# Altium project STM32F4 MCU.PrjPcb
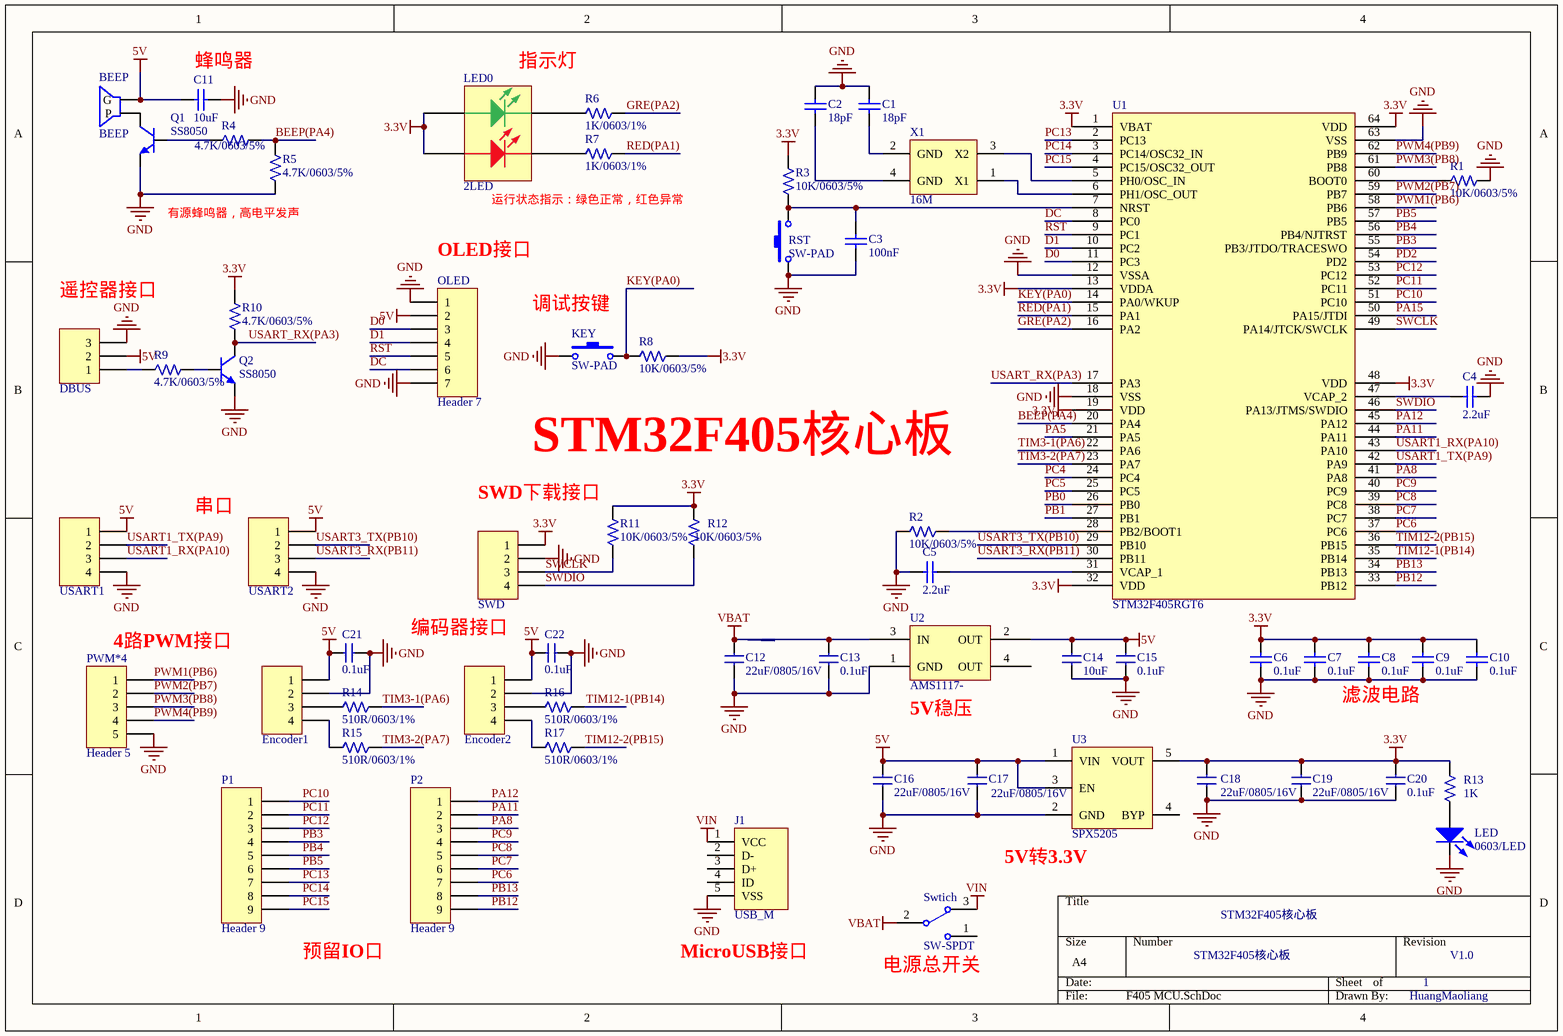
[diagram p0: F405 MCU.SchDoc]
1 sheet, 62 parts. Net scope: global (net labels, ports and power ports of the same name join across sheets).
Board file: F405 MCU.PcbDoc

## Sheet F405 MCU.SchDoc
size A4

### Parts
BEEP  BEEP  [BELL-5]
C1  18pF  [CAP-0603]
C2  18pF  [CAP-0603]
C3  100nF  [CAP-0603]
C4  2.2uF  [CAP-0603]
C5  2.2uF  [CAP-0603]
C6  0.1uF  [CAP-0603]
C7  0.1uF  [CAP-0603]
C8  0.1uF  [CAP-0603]
C9  0.1uF  [CAP-0603]
C10  0.1uF  [CAP-0603]
C11  10uF  [CAP-0603]
C12  22uF/0805/16V  [0805]
C13  0.1uF  [0603]
C14  10uF  [0603]
C15  0.1uF  [0603]
C16  22uF/0805/16V  [0805]
C17  22uF/0805/16V  [0805]
C18  22uF/0805/16V  [0805]
C19  22uF/0805/16V  [0805]
C20  0.1uF  [0603]
C21  0.1uF  [0603]
C22  0.1uF  [0603]
DBUS  Header 3  [HDR3X1_A]  (value not drawn)
Encoder1  Header 4  [HDR4X1_A]  (value not drawn)
Encoder2  Header 4  [HDR4X1_A]  (value not drawn)
J1  USB_M  [USB-MICRO]
KEY  SW-PAD  [SW_PAD1]
LED  0603/LED  [0603]
LED0  2LED  [LED-2-1206]
OLED  Header 7  [HDR1X7]
P1  Header 9  [HDR1X9]
P2  Header 9  [HDR1X9]
PWM*4  Header 5  [HDR1X5]
Q1  SS8050  [SOT-23]
Q2  SS8050  [SOT-23]
R1  10K/0603/5%  [0603]
R2  10K/0603/5%  [0603]
R3  10K/0603/5%  [0603]
R4  4.7K/0603/5%  [0603]
R5  4.7K/0603/5%  [0603]
R6  1K/0603/1%  [0603]
R7  1K/0603/1%  [0603]
R8  10K/0603/5%  [0603]
R9  4.7K/0603/5%  [0603]
R10  4.7K/0603/5%  [0603]
R11  10K/0603/5%  [0603]
R12  10K/0603/5%  [0603]
R13  1K  [0603]
R14  510R/0603/1%  [0603]
R15  510R/0603/1%  [0603]
R16  510R/0603/1%  [0603]
R17  510R/0603/1%  [0603]
RST  SW-PAD  [SW_PAD1]
SWD  Header 4  [HDR4X1_A]  (value not drawn)
Swtich  SW-SPDT  [MSK-12D19]
U1  STM32F405RGT6  [STM32F405RGT6 - duplicate]
U2  AMS1117-  [SOT-89-3]
U3  SPX5205  [SPX5205M5-3.3V]
USART1  Header 4  [HDR4X1_A]  (value not drawn)
USART2  Header 4  [HDR4X1_A]  (value not drawn)
X1  16M  [X-3225]

### Nets
3.3V: C6.2 C7.2 C8.2 C9.2 C10.2 C18.2 C19.2 C20.2 LED0.1 LED0.2 R3.2 R8.2 R10.2 R11.2 R12.2 R13.2 SWD.1 U1.1(VBAT) U1.13(VDDA) U1.19(VDD) U1.32(VDD) U1.48(VDD) U1.64(VDD) U3.5(VOUT)
5V: BEEP.2(G) C11.1 C14.2 C15.2 C16.2 C17.2 C21.2 C22.1 DBUS.2 Encoder1.1 Encoder2.1 OLED.2 U2.2(OUT) U3.1(VIN) U3.3(EN) USART1.1 USART2.1
GND: C1.2 C2.2 C3.1 C4.1 C5.2 C6.1 C7.1 C8.1 C9.1 C10.1 C11.2 C12.1 C13.1 C14.1 C15.1 C16.1 C17.1 C18.1 C19.1 C20.1 C21.1 C22.2 DBUS.3 Encoder1.2 Encoder2.2 J1.5(VSS) KEY.1 LED.2(K) OLED.1 OLED.7 PWM*4.5 Q1.2(E) Q2.2(E) R1.2 R2.1 R5.2 RST.1 SWD.2 U1.12(VSSA) U1.18(VSS) U1.63(VSS) U2.1(GND) U3.2(GND) USART1.4 USART2.4
VBAT: C12.2 C13.2 Swtich.2 U2.3(IN)
VIN: J1.1(VCC) Swtich.3
BEEP(PA4): R4.1 R5.1 U1.20(PA4)
D0: OLED.3 U1.11(PC3)
D1: OLED.4 U1.10(PC2)
DC: OLED.6 U1.8(PC0)
GRE(PA2): R6.2 U1.16(PA2)
KEY(PA0): KEY.2 R8.1 U1.14(PA0/WKUP)
PA5: U1.21(PA5)
PA8: P2.3 U1.41(PA8)
PA11: P2.2 U1.44(PA11)
PA12: P2.1 U1.45(PA12)
PA15: U1.50(PA15/JTDI)
PB0: U1.26(PB0)
PB1: U1.27(PB1)
PB3: P1.4 U1.55(PB3/JTDO/TRACESWO)
PB4: P1.5 U1.56(PB4/NJTRST)
PB5: P1.6 U1.57(PB5)
PB12: P2.9 U1.33(PB12)
PB13: P2.8 U1.34(PB13)
PC4: U1.24(PC4)
PC5: U1.25(PC5)
PC6: P2.7 U1.37(PC6)
PC7: P2.6 U1.38(PC7)
PC8: P2.5 U1.39(PC8)
PC9: P2.4 U1.40(PC9)
PC10: P1.1 U1.51(PC10)
PC11: P1.2 U1.52(PC11)
PC12: P1.3 U1.53(PC12)
PC13: P1.7 U1.2(PC13)
PC14: P1.8 U1.3(PC14/OSC32_IN)
PC15: P1.9 U1.4(PC15/OSC32_OUT)
PD2: U1.54(PD2)
PWM1(PB6): PWM*4.1 U1.58(PB6)
PWM2(PB7): PWM*4.2 U1.59(PB7)
PWM3(PB8): PWM*4.3 U1.61(PB8)
PWM4(PB9): PWM*4.4 U1.62(PB9)
RED(PA1): R7.2 U1.15(PA1)
RST: OLED.5 U1.9(PC1)
SWCLK: R11.1 SWD.3 U1.49(PA14/JTCK/SWCLK)
SWDIO: R12.1 SWD.4 U1.46(PA13/JTMS/SWDIO)
TIM3-1(PA6): R14.2 U1.22(PA6)
TIM3-2(PA7): R15.2 U1.23(PA7)
TIM12-1(PB14): R16.2 U1.35(PB14)
TIM12-2(PB15): R17.2 U1.36(PB15)
USART1_RX(PA10): U1.43(PA10) USART1.3
USART1_TX(PA9): U1.42(PA9) USART1.2
USART3_RX(PB11): U1.30(PB11) USART2.3
USART3_TX(PB10): U1.29(PB10) USART2.2
USART_RX(PA3): Q2.3(C) R10.1 U1.17(PA3)
NetBEEP_1: BEEP.1(P) Q1.3(C)
NetC1_1: C1.1 X1.2(GND)
NetC2_1: C2.1 X1.4(GND)
NetC3_2: C3.2 R3.1 RST.2 U1.7(NRST)
NetC4_2: C4.2 U1.47(VCAP_2)
NetC5_1: C5.1 U1.31(VCAP_1)
NetDBUS_1: DBUS.1 R9.1
NetEncoder1_3: Encoder1.3 R14.1
NetEncoder1_4: Encoder1.4 R15.1
NetEncoder2_3: Encoder2.3 R16.1
NetEncoder2_4: Encoder2.4 R17.1
NetLED0_3: LED0.3 R6.1
NetLED0_4: LED0.4 R7.1
NetLED_1: LED.1(A) R13.1
NetQ1_1: Q1.1(B) R4.2
NetQ2_1: Q2.1(B) R9.2
NetR1_1: R1.1 U1.60(BOOT0)
NetR2_2: R2.2 U1.28(PB2/BOOT1)
NetU1_5: U1.5(PH0/OSC_IN) X1.3(X2)
NetU1_6: U1.6(PH1/OSC_OUT) X1.1(X1)

Not connected (* = marked no-connect by the designer): J1 2(D-) 3(D+) 4(ID); Swtich 1; U2 4(OUT); U3 4(BYP)

### Notes on the sheet
- (near C11) 蜂鸣器
- 指示灯
- 有源蜂鸣器，高电平发声
- 运行状态指示：绿色正常，红色异常
- (near DBUS) 遥控器接口
- (near OLED) OLED接口
- (near KEY) 调试按键
- 串口
- (near SWD) SWD下载接口
- STM32F405核心板
- (near PWM*4) 4路PWM接口
- 编码器接口
- (near U2) 5V稳压
- (near C8) 滤波电路
- (near U3) 5V转3.3V
- (near P1) 预留IO口
- (near J1) MicroUSB接口
- (near Swtich) 电源总开关
- 1
- V1.0
- HuangMaoliang

### Library data of the parts
C1-C11 = Cap: 无极性电容; Value: 100pF; Published: 8-Jun-2000; LatestRevisionDate: 17-Jul-2002; LatestRevisionNote: Re-released for DXP Platform.; PackageReference: RAD-0.3; Publisher: Altium Limited
C12 C16-C19 = CAP/0805
C13-C15 C20-C22 = CAP/0603
DBUS = Header 3: 接插件; LatestRevisionDate: 17-Jul-2002; LatestRevisionNote: Re-released for DXP Platform.; Publisher: Altium Limited
Encoder1 Encoder2 SWD USART1 USART2 = Header 4: 接插件; LatestRevisionDate: 17-Jul-2002; LatestRevisionNote: Re-released for DXP Platform.; Publisher: Altium Limited
J1 = USB_M: MicroUSB接口
KEY RST = SW-PAD: 微动开关; Published: 24-Mar-1999; LatestRevisionDate: 17-Jul-2002; LatestRevisionNote: Re-released for DXP Platform.; PackageReference: SPST-2; Publisher: Altium Limited
OLED = Header 7: Header, 7-Pin; LatestRevisionDate: 17-Jul-2002; LatestRevisionNote: Re-released for DXP Platform.; Publisher: Altium Limited
P1 P2 = Header 9: Header, 9-Pin; LatestRevisionDate: 17-Jul-2002; LatestRevisionNote: Re-released for DXP Platform.; Publisher: Altium Limited
PWM*4 = Header 5: Header, 5-Pin; LatestRevisionDate: 17-Jul-2002; LatestRevisionNote: Re-released for DXP Platform.; Publisher: Altium Limited
Q1 Q2 = SS8050: NPN贴片三极管; Published: 8-Jun-2000; LatestRevisionDate: 15-Jan-2003; LatestRevisionNote: PCB Footprint 'BCY-W3/D4.7' replaced; DatasheetDocument: 1997; PackageDocument: Sep-1998; PackageReference: TO-92A; Publisher: Altium Limited; Code_JEDEC: TO-92A; ComponentLink1Description: Manufacturer Link; ComponentLink1URL: http://www.fairchildsemi.com/; ComponentLink2Description: Datasheet; ComponentLink2URL: http://www.fairchildsemi.com/ds/2N%2F2N3904.pdf
R1-R17 = RES/0603
Swtich = SW-SPDT: 开关; Published: 24-Mar-1999; LatestRevisionDate: 17-Dec-2003; LatestRevisionNote: Schematic revised, PCB Footprint replaced.; DatasheetDocument: 05-Dec-2000; PackageReference: TL36WW15050; Publisher: Altium Limited; ComponentLink1Description: Manufacturer Link; ComponentLink1URL: http://www.apem.com
U2 = AMS1117: 稳压芯片
U3 = SPX5205M5-3.3V: 5转3.3V LDO
X1 = XTAL-M: 贴片晶振